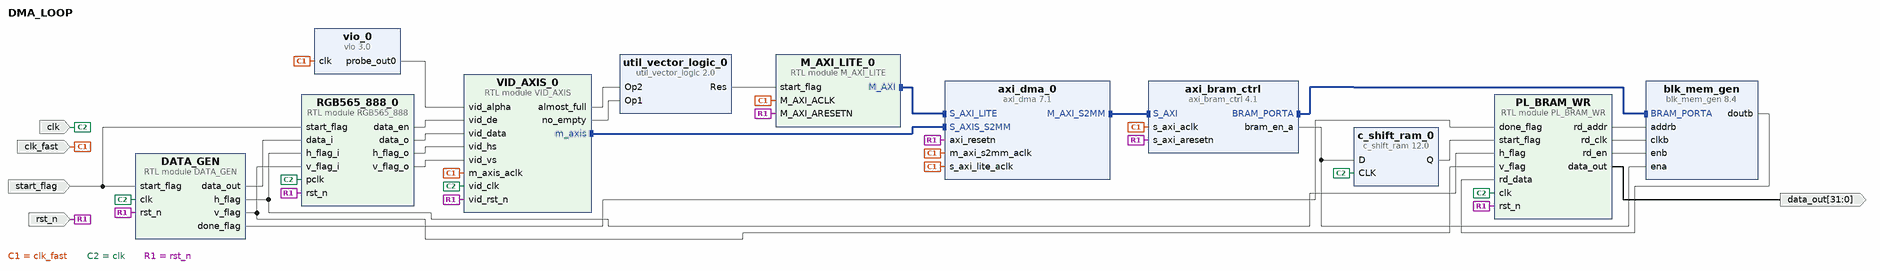
[diagram p0: block diagram of the top level]
# Vivado block design DMA_LOOP, xc7z020clg400-1, Vivado 2022.1
create_bd_design DMA_LOOP

create_bd_port -dir I -type clk clk
create_bd_port -dir I -type rst rst_n
create_bd_port -dir I start_flag
create_bd_port -dir O -from 31 -to 0 data_out
create_bd_port -dir I clk_fast

create_bd_cell -type module -reference DATA_GEN DATA_GEN
create_bd_cell -type module -reference PL_BRAM_WR PL_BRAM_WR
create_bd_cell -type ip -vlnv xilinx.com:ip:axi_bram_ctrl:4.1 axi_bram_ctrl
set_property -dict {CONFIG.SINGLE_PORT_BRAM 1} [get_bd_cells axi_bram_ctrl]
create_bd_cell -type ip -vlnv xilinx.com:ip:axi_dma:7.1 axi_dma_0
set_property -dict [list \
  CONFIG.c_include_mm2s 0 \
  CONFIG.c_include_s2mm_dre 1 \
  CONFIG.c_include_sg 0 \
  CONFIG.c_s2mm_burst_size 256 \
  CONFIG.c_sg_length_width 26 \
] [get_bd_cells axi_dma_0]
create_bd_cell -type ip -vlnv xilinx.com:ip:blk_mem_gen:8.4 blk_mem_gen
set_property -dict [list \
  CONFIG.EN_SAFETY_CKT false \
  CONFIG.Enable_32bit_Address true \
  CONFIG.Enable_B Use_ENB_Pin \
  CONFIG.Memory_Type True_Dual_Port_RAM \
  CONFIG.Operating_Mode_A WRITE_FIRST \
  CONFIG.Port_A_Write_Rate 50 \
  CONFIG.Port_B_Clock 100 \
  CONFIG.Port_B_Enable_Rate 100 \
  CONFIG.Port_B_Write_Rate 50 \
  CONFIG.Register_PortA_Output_of_Memory_Primitives false \
  CONFIG.Register_PortB_Output_of_Memory_Primitives false \
  CONFIG.Use_RSTA_Pin true \
  CONFIG.Use_RSTB_Pin true \
  CONFIG.use_bram_block BRAM_Controller \
] [get_bd_cells blk_mem_gen]
create_bd_cell -type ip -vlnv xilinx.com:ip:c_shift_ram:12.0 c_shift_ram_0
set_property -dict {CONFIG.AsyncInitVal 0 CONFIG.DefaultData 0 CONFIG.Depth 10 CONFIG.Width 1} [get_bd_cells c_shift_ram_0]
create_bd_cell -type ip -vlnv xilinx.com:ip:util_vector_logic:2.0 util_vector_logic_0
set_property -dict {CONFIG.C_SIZE 1} [get_bd_cells util_vector_logic_0]
create_bd_cell -type ip -vlnv xilinx.com:ip:vio:3.0 vio_0
set_property -dict {CONFIG.C_NUM_PROBE_IN 0 CONFIG.C_PROBE_OUT0_INIT_VAL 0xfF CONFIG.C_PROBE_OUT0_WIDTH 8} [get_bd_cells vio_0]
create_bd_cell -type module -reference RGB565_888 RGB565_888_0
create_bd_cell -type module -reference VID_AXIS VID_AXIS_0
create_bd_cell -type module -reference M_AXI_LITE M_AXI_LITE_0

# ---- connections ----

connect_bd_intf_net [get_bd_intf_pins M_AXI_LITE_0/M_AXI] [get_bd_intf_pins axi_dma_0/S_AXI_LITE]
connect_bd_intf_net [get_bd_intf_pins VID_AXIS_0/m_axis] [get_bd_intf_pins axi_dma_0/S_AXIS_S2MM]
connect_bd_intf_net -intf_net axi_bram_ctrl_0_BRAM_PORTA [get_bd_intf_pins axi_bram_ctrl/BRAM_PORTA] [get_bd_intf_pins blk_mem_gen/BRAM_PORTA]
connect_bd_intf_net [get_bd_intf_pins axi_bram_ctrl/S_AXI] [get_bd_intf_pins axi_dma_0/M_AXI_S2MM]
connect_bd_net -net DATA_GEN_0_done_flag [get_bd_pins DATA_GEN/done_flag] [get_bd_pins PL_BRAM_WR/done_flag]
connect_bd_net -net DATA_GEN_0_h_flag [get_bd_pins DATA_GEN/h_flag] [get_bd_pins PL_BRAM_WR/h_flag] [get_bd_pins RGB565_888_0/h_flag_i]
connect_bd_net -net DATA_GEN_0_v_flag [get_bd_pins DATA_GEN/v_flag] [get_bd_pins PL_BRAM_WR/v_flag] [get_bd_pins RGB565_888_0/v_flag_i]
connect_bd_net [get_bd_pins DATA_GEN/data_out] [get_bd_pins RGB565_888_0/data_i]
connect_bd_net [get_bd_pins PL_BRAM_WR/data_out] [get_bd_ports data_out]
connect_bd_net [get_bd_pins PL_BRAM_WR/rd_addr] [get_bd_pins blk_mem_gen/addrb]
connect_bd_net [get_bd_pins PL_BRAM_WR/rd_clk] [get_bd_pins blk_mem_gen/clkb]
connect_bd_net [get_bd_pins PL_BRAM_WR/rd_en] [get_bd_pins blk_mem_gen/enb]
connect_bd_net [get_bd_pins RGB565_888_0/data_en] [get_bd_pins VID_AXIS_0/vid_de]
connect_bd_net [get_bd_pins RGB565_888_0/data_o] [get_bd_pins VID_AXIS_0/vid_data]
connect_bd_net [get_bd_pins RGB565_888_0/h_flag_o] [get_bd_pins VID_AXIS_0/vid_hs]
connect_bd_net [get_bd_pins RGB565_888_0/v_flag_o] [get_bd_pins VID_AXIS_0/vid_vs]
connect_bd_net [get_bd_pins VID_AXIS_0/almost_full] [get_bd_pins util_vector_logic_0/Op2]
connect_bd_net [get_bd_pins VID_AXIS_0/no_empty] [get_bd_pins util_vector_logic_0/Op1]
connect_bd_net [get_bd_pins axi_bram_ctrl/bram_en_a] [get_bd_pins blk_mem_gen/ena] [get_bd_pins c_shift_ram_0/D]
connect_bd_net [get_bd_pins blk_mem_gen/doutb] [get_bd_pins PL_BRAM_WR/rd_data]
connect_bd_net [get_bd_pins c_shift_ram_0/Q] [get_bd_pins PL_BRAM_WR/start_flag]
connect_bd_net [get_bd_ports clk_fast] \
  [get_bd_pins axi_bram_ctrl/s_axi_aclk] [get_bd_pins axi_dma_0/s_axi_lite_aclk] [get_bd_pins axi_dma_0/m_axi_s2mm_aclk] \
  [get_bd_pins vio_0/clk] [get_bd_pins VID_AXIS_0/m_axis_aclk] [get_bd_pins M_AXI_LITE_0/M_AXI_ACLK]
connect_bd_net -net clk_wiz_0_clk_out1 [get_bd_ports clk] \
  [get_bd_pins DATA_GEN/clk] [get_bd_pins PL_BRAM_WR/clk] [get_bd_pins c_shift_ram_0/CLK] [get_bd_pins RGB565_888_0/pclk] \
  [get_bd_pins VID_AXIS_0/vid_clk]
connect_bd_net -net rst_n_0_1 [get_bd_ports rst_n] \
  [get_bd_pins DATA_GEN/rst_n] [get_bd_pins PL_BRAM_WR/rst_n] [get_bd_pins axi_bram_ctrl/s_axi_aresetn] \
  [get_bd_pins axi_dma_0/axi_resetn] [get_bd_pins RGB565_888_0/rst_n] [get_bd_pins VID_AXIS_0/vid_rst_n] \
  [get_bd_pins M_AXI_LITE_0/M_AXI_ARESETN]
connect_bd_net -net start_flag_0_1 [get_bd_ports start_flag] [get_bd_pins DATA_GEN/start_flag] [get_bd_pins RGB565_888_0/start_flag]
connect_bd_net [get_bd_pins util_vector_logic_0/Res] [get_bd_pins M_AXI_LITE_0/start_flag]
connect_bd_net [get_bd_pins vio_0/probe_out0] [get_bd_pins VID_AXIS_0/vid_alpha]

# ---- address map ----
assign_bd_address -offset 0x00000000 -range 64K -target_address_space [get_bd_addr_spaces axi_dma_0/Data_S2MM] [get_bd_addr_segs axi_bram_ctrl/S_AXI/Mem0]
assign_bd_address -offset 0x000 -range 1K -target_address_space [get_bd_addr_spaces M_AXI_LITE_0/M_AXI] [get_bd_addr_segs axi_dma_0/S_AXI_LITE/Reg]

validate_bd_design
save_bd_design
